# Altium schematic sheet 1 top.SchDoc
size A4; SheetNumber: 1; SheetTotal: 6
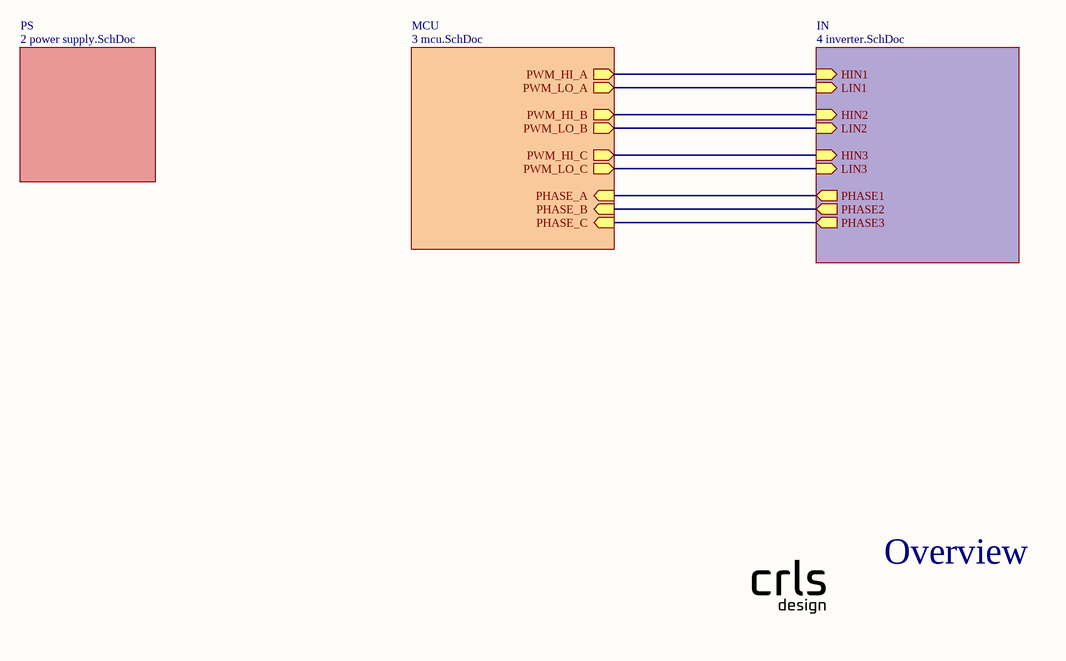
[diagram p0: 1 top.SchDoc]

## Sub-sheets
IN = 4 inverter.SchDoc: HIN1 (in), HIN2 (in), HIN3 (in), LIN1 (in), LIN2 (in), LIN3 (in), PHASE1 (out), PHASE2 (out), PHASE3 (out)
MCU = 3 mcu.SchDoc: PHASE_A (in), PHASE_B (in), PHASE_C (in), PWM_HI_A (out), PWM_LO_A (out), PWM_HI_B (out), PWM_LO_B (out), PWM_HI_C (out), PWM_LO_C (out)
PS = 2 power supply.SchDoc: no entries

## Nets
(unnamed): sheet MCU/PHASE_A, sheet IN/PHASE1
(unnamed): sheet MCU/PHASE_B, sheet IN/PHASE2
(unnamed): sheet MCU/PHASE_C, sheet IN/PHASE3
(unnamed): sheet MCU/PWM_HI_A, sheet IN/HIN1
(unnamed): sheet MCU/PWM_LO_A, sheet IN/LIN1
(unnamed): sheet MCU/PWM_HI_B, sheet IN/HIN2
(unnamed): sheet MCU/PWM_LO_B, sheet IN/LIN2
(unnamed): sheet MCU/PWM_HI_C, sheet IN/HIN3
(unnamed): sheet MCU/PWM_LO_C, sheet IN/LIN3

## Notes on the sheet
- Overview